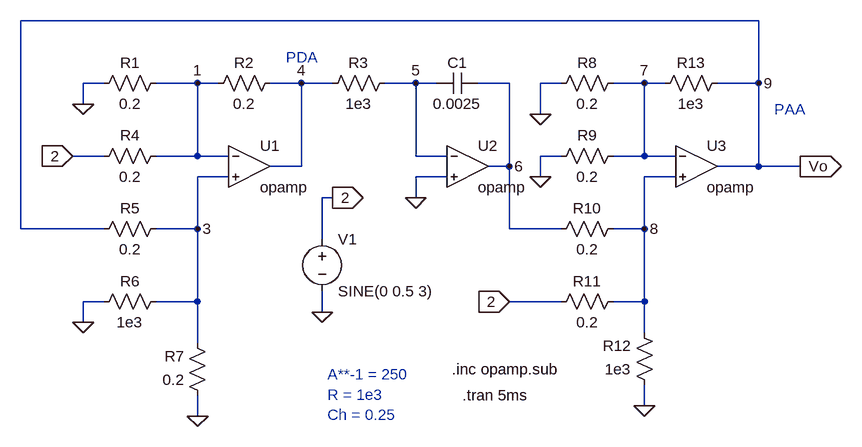
[diagram p0: schematic integrador fraccional_.asc]
integrador fraccional_.asc, the LTspice schematic file:
Version 4
SHEET 1 1256 848
WIRE 1104 64 -32 64
WIRE 96 160 64 160
WIRE 240 160 176 160
WIRE 272 160 240 160
WIRE 400 160 352 160
WIRE 448 160 400 160
WIRE 576 160 528 160
WIRE 608 160 576 160
WIRE 720 160 672 160
WIRE 800 160 768 160
WIRE 928 160 880 160
WIRE 960 160 928 160
WIRE 1104 160 1104 64
WIRE 1104 160 1040 160
WIRE 64 192 64 160
WIRE 768 208 768 160
WIRE 96 272 48 272
WIRE 240 272 240 160
WIRE 240 272 176 272
WIRE 288 272 240 272
WIRE 576 272 576 160
WIRE 624 272 576 272
WIRE 800 272 768 272
WIRE 928 272 928 160
WIRE 928 272 880 272
WIRE 976 272 928 272
WIRE 400 288 400 160
WIRE 400 288 352 288
WIRE 720 288 720 160
WIRE 720 288 688 288
WIRE 1104 288 1104 160
WIRE 1104 288 1040 288
WIRE 1168 288 1104 288
WIRE 288 304 240 304
WIRE 624 304 576 304
WIRE 768 304 768 272
WIRE 976 304 928 304
WIRE 448 336 432 336
WIRE 576 336 576 304
WIRE -32 384 -32 64
WIRE 96 384 -32 384
WIRE 240 384 240 304
WIRE 240 384 176 384
WIRE 720 384 720 288
WIRE 800 384 720 384
WIRE 928 384 928 304
WIRE 928 384 880 384
WIRE 432 400 432 336
WIRE 96 496 64 496
WIRE 240 496 240 384
WIRE 240 496 176 496
WIRE 800 496 720 496
WIRE 928 496 928 384
WIRE 928 496 880 496
WIRE 432 512 432 480
WIRE 64 528 64 496
WIRE 928 544 928 496
WIRE 240 560 240 496
WIRE 928 656 928 624
WIRE 240 672 240 640
FLAG 240 672 0
FLAG 928 656 0
FLAG 768 304 0
FLAG 768 208 0
FLAG 64 192 0
FLAG 64 528 0
FLAG 1168 288 Vo
IOPIN 1168 288 Out
FLAG 240 160 1
FLAG 240 384 3
FLAG 400 160 4
FLAG 576 160 5
FLAG 720 288 6
FLAG 928 160 7
FLAG 1104 160 9
FLAG 928 384 8
FLAG 576 336 0
FLAG 432 512 0
FLAG 448 336 2
IOPIN 448 336 Out
FLAG 48 272 2
IOPIN 48 272 In
FLAG 720 496 2
IOPIN 720 496 In
SYMBOL OpAmps\\opamp 320 224 R0
SYMATTR InstName U1
SYMBOL OpAmps\\opamp 656 224 R0
SYMATTR InstName U2
SYMBOL OpAmps\\opamp 1008 224 R0
SYMATTR InstName U3
SYMBOL res 192 144 R90
WINDOW 0 0 56 VBottom 2
WINDOW 3 32 56 VTop 2
SYMATTR InstName R1
SYMATTR Value 0.2
SYMBOL res 368 144 R90
WINDOW 0 0 56 VBottom 2
WINDOW 3 32 56 VTop 2
SYMATTR InstName R2
SYMATTR Value 0.2
SYMBOL res 544 144 R90
WINDOW 0 0 56 VBottom 2
WINDOW 3 32 56 VTop 2
SYMATTR InstName R3
SYMATTR Value 1e3
SYMBOL res 192 256 R90
WINDOW 0 0 56 VBottom 2
WINDOW 3 32 56 VTop 2
SYMATTR InstName R4
SYMATTR Value 0.2
SYMBOL res 192 368 R90
WINDOW 0 0 56 VBottom 2
WINDOW 3 32 56 VTop 2
SYMATTR InstName R5
SYMATTR Value 0.2
SYMBOL res 192 480 R90
WINDOW 0 0 56 VBottom 2
WINDOW 3 32 56 VTop 2
SYMATTR InstName R6
SYMATTR Value 1e3
SYMBOL res 256 656 R180
WINDOW 0 36 76 Left 2
WINDOW 3 36 40 Left 2
SYMATTR InstName R7
SYMATTR Value 0.2
SYMBOL cap 672 144 R90
WINDOW 0 0 32 VBottom 2
WINDOW 3 32 32 VTop 2
SYMATTR InstName C1
SYMATTR Value 0.0025
SYMBOL res 896 144 R90
WINDOW 0 0 56 VBottom 2
WINDOW 3 32 56 VTop 2
SYMATTR InstName R8
SYMATTR Value 0.2
SYMBOL res 896 256 R90
WINDOW 0 0 56 VBottom 2
WINDOW 3 32 56 VTop 2
SYMATTR InstName R9
SYMATTR Value 0.2
SYMBOL res 896 368 R90
WINDOW 0 0 56 VBottom 2
WINDOW 3 32 56 VTop 2
SYMATTR InstName R10
SYMATTR Value 0.2
SYMBOL res 896 480 R90
WINDOW 0 0 56 VBottom 2
WINDOW 3 32 56 VTop 2
SYMATTR InstName R11
SYMATTR Value 0.2
SYMBOL res 944 640 R180
WINDOW 0 36 76 Left 2
WINDOW 3 36 40 Left 2
SYMATTR InstName R12
SYMATTR Value 1e3
SYMBOL res 944 176 R270
WINDOW 0 32 56 VTop 2
WINDOW 3 0 56 VBottom 2
SYMATTR InstName R13
SYMATTR Value 1e3
SYMBOL voltage 432 384 R0
WINDOW 123 0 0 Left 0
WINDOW 39 0 0 Left 0
SYMATTR InstName V1
SYMATTR Value SINE(0 0.5 3)
TEXT 440 608 Left 2 ;A**-1 = 250\nR = 1e3\nCh = 0.25
TEXT 648 640 Left 2 !.tran 5ms
TEXT 632 600 Left 2 !.inc opamp.sub
TEXT 376 120 Left 2 ;PDA
TEXT 1128 200 Left 2 ;PAA

The netlist it stands for:
* integrador fraccional_.asc
XU1 1 3 4 opamp Aol=100K GBW=10Meg  ; pins invin noninvin out
XU2 5 0 6 opamp Aol=100K GBW=10Meg  ; pins invin noninvin out
XU3 7 8 9 opamp Aol=100K GBW=10Meg  ; pins invin noninvin out
R1 1 0 0.2
R2 4 1 0.2
R3 5 4 1e3
R4 1 2 0.2
R5 3 9 0.2
R6 3 0 1e3
R7 0 3 0.2
C1 6 5 0.0025
R8 7 0 0.2
R9 7 0 0.2
R10 8 6 0.2
R11 8 2 0.2
R12 0 8 1e3
R13 7 9 1e3
V1 2 0 SINE(0 0.5 3)
* A**-1 = 250
* R = 1e3
* Ch = 0.25
.tran 5ms
.inc opamp.sub
* PDA
* PAA
.backanno
.end